# Altium schematic sheet DI23.SchDoc
size A; SheetNumber: 1; SheetTotal: 1
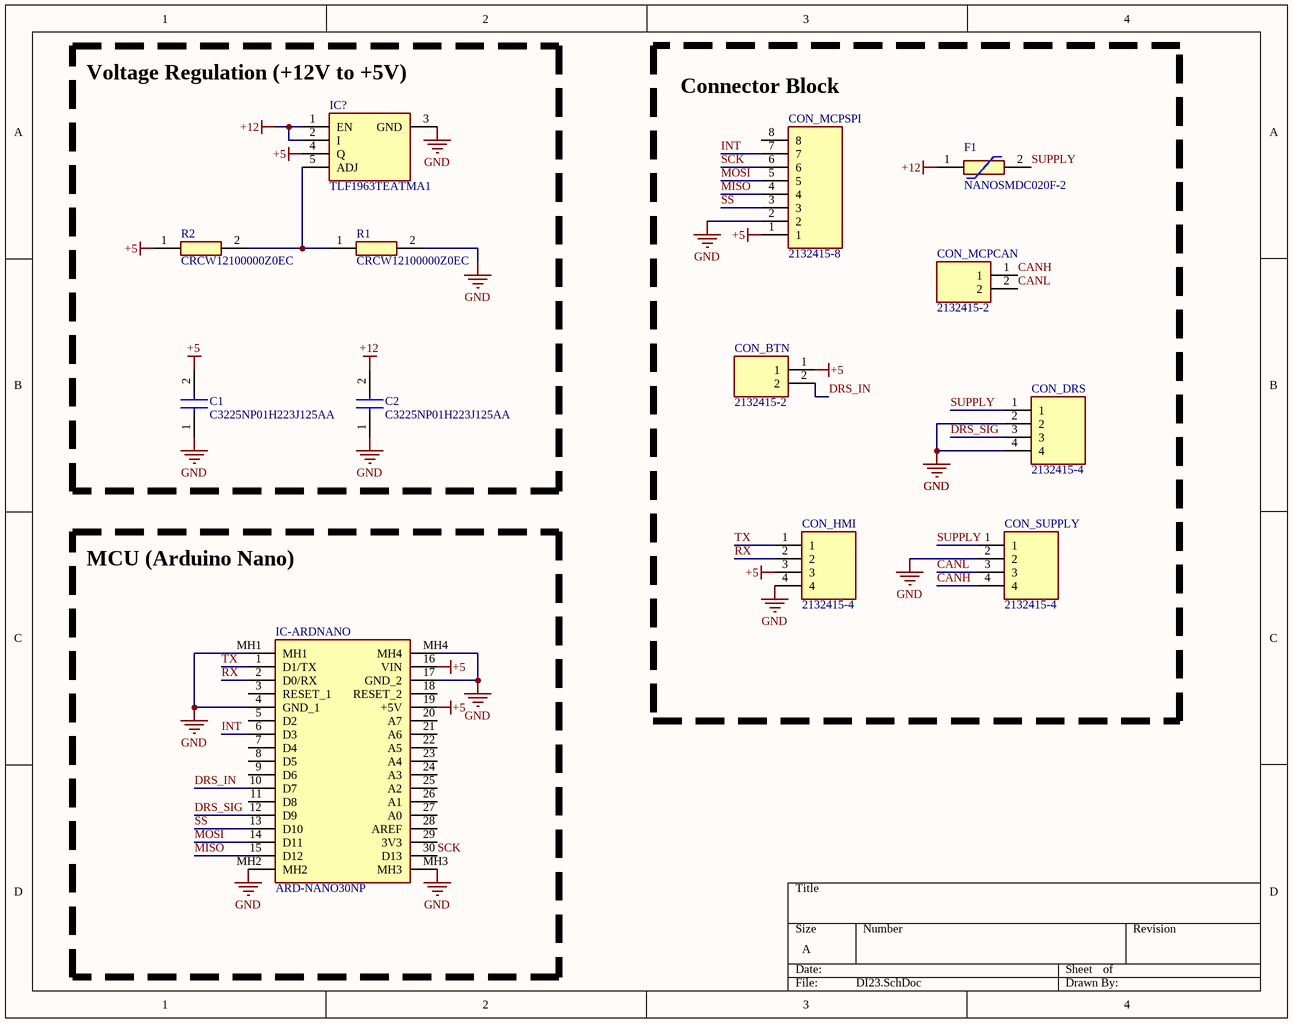
[diagram p0: DI23.SchDoc]

## Parts
C1  C3225NP01H223J125AA  [CAPC3225X125N]
C2  C3225NP01H223J125AA  [CAPC3225X125N]
CON_BTN  2132415-2  [21324152]
CON_DRS  2132415-4  [SHDR4W62P0X250_1X4_1250X640X880P]
CON_HMI  2132415-4  [SHDR4W62P0X250_1X4_1250X640X880P]
CON_MCPCAN  2132415-2  [21324152]
CON_MCPSPI  2132415-8  [21324158]
CON_SUPPLY  2132415-4  [SHDR4W62P0X250_1X4_1250X640X880P]
F1  NANOSMDC020F-2  [NANOSMDC016F2]
IC-ARDNANO  ARD-NANO30NP  [ARDNANO30NP]
IC?  TLF1963TEATMA1  [TLF1963TEATMA1]
R1  CRCW12100000Z0EC  [RESC3225X60N]
R2  CRCW12100000Z0EC  [RESC3225X60N]

## Blocks framed on the sheet
Voltage Regulation (+12V to +5V): C1 C2 IC? R1 R2
Connector Block: CON_BTN CON_DRS CON_HMI CON_MCPCAN CON_MCPSPI CON_SUPPLY F1
MCU (Arduino Nano): IC-ARDNANO

## Nets
+5: C1.2 CON_BTN.1 CON_HMI.3 CON_MCPSPI.1 IC-ARDNANO.16(VIN) IC-ARDNANO.19(+5V) IC?.4(Q) R2.1
+12: C2.2 F1.1 IC?.1(EN) IC?.2(I)
GND: C1.1 C2.1 CON_DRS.2 CON_DRS.4 CON_HMI.4 CON_MCPSPI.2 CON_SUPPLY.2 IC-ARDNANO.4(GND_1) IC-ARDNANO.17(GND_2) IC-ARDNANO.MH1 IC-ARDNANO.MH2 IC-ARDNANO.MH3 IC-ARDNANO.MH4 IC?.3(GND) R1.2
CANH: CON_MCPCAN.1 CON_SUPPLY.4
CANL: CON_MCPCAN.2 CON_SUPPLY.3
DRS_IN: CON_BTN.2 IC-ARDNANO.10(D7)
DRS_SIG: CON_DRS.3 IC-ARDNANO.12(D9)
INT: CON_MCPSPI.7 IC-ARDNANO.6(D3)
MISO: CON_MCPSPI.4 IC-ARDNANO.15(D12)
MOSI: CON_MCPSPI.5 IC-ARDNANO.14(D11)
RX: CON_HMI.2 IC-ARDNANO.2(D0/RX)
SCK: CON_MCPSPI.6 IC-ARDNANO.30(D13)
SS: CON_MCPSPI.3 IC-ARDNANO.13(D10)
SUPPLY: CON_DRS.1 CON_SUPPLY.1 F1.2
TX: CON_HMI.1 IC-ARDNANO.1(D1/TX)
NetIC?_5: IC?.5(ADJ) R1.1 R2.2

Not connected (* = marked no-connect by the designer): CON_MCPSPI 8; IC-ARDNANO 3(RESET_1) 5(D2) 7(D4) 8(D5) 9(D6) 11(D8) 18(RESET_2) 20(A7) 21(A6) 22(A5) 23(A4) 24(A3) 25(A2) 26(A1) 27(A0) 28(AREF) 29(3V3)

## Library data of the parts
C1 C2 = C3225NP01H223J125AA: Capacitor; Manufacturer_Name: TDK; Datasheet Link: https://product.tdk.com/info/en/catalog/datasheets/mlcc_commercial_midvoltage_en.pdf; Height: 1.25mm; Manufacturer_Part_Number: C3225NP01H223J125AA; Mouser Part Number: 810-C3225NP01H223J1A; Mouser Price/Stock: https://www.mouser.co.uk/ProductDetail/TDK/C3225NP01H223J125AA?qs=xLDY6iXSiQYCNOB4fgAXGA%3D%3D
CON_BTN CON_MCPCAN = 2132415-2: Connector; Manufacturer_Name: TE Connectivity; Datasheet Link: https://componentsearchengine.com/Datasheets/1/2132415-2.pdf; Height: 9mm; Manufacturer_Part_Number: 2132415-2; Mouser Part Number: 571-2132415-2; Mouser Price/Stock: https://www.mouser.co.uk/ProductDetail/TE-Connectivity/2132415-2?qs=XhI5AayaxxWCihtdUAcw3Q%3D%3D; Arrow Part Number: 2132415-2; Arrow Price/Stock: https://www.arrow.com/en/products/2132415-2/te-connectivity?region=nac
CON_DRS CON_HMI CON_SUPPLY = 2132415-4: Connector; Manufacturer_Name: TE Connectivity; Datasheet Link: https://www.te.com/commerce/DocumentDelivery/DDEController?Action=srchrtrv&DocNm=2132415&DocType=Customer+Drawing&DocLang=English&DocFormat=pdf&PartCntxt=2132415-4; Height: 8.8mm; Manufacturer_Part_Number: 2132415-4; Mouser Part Number: 571-2132415-4; Mouser Price/Stock: https://www.mouser.co.uk/ProductDetail/TE-Connectivity/2132415-4?qs=XhI5AayaxxVzHDT9ZkxhEA%3D%3D; Arrow Part Number: 2132415-4; Arrow Price/Stock: https://www.arrow.com/en/products/2132415-4/te-connectivity?region=nac
CON_MCPSPI = 2132415-8: Connector; Manufacturer_Name: TE Connectivity; Datasheet Link: https://componentsearchengine.com/Datasheets/2/2132415-8.pdf; Height: 8.93mm; Manufacturer_Part_Number: 2132415-8; Mouser Part Number: 571-2132415-8; Mouser Price/Stock: https://www.mouser.co.uk/ProductDetail/TE-Connectivity/2132415-8?qs=XhI5AayaxxU5%2FK%252BXTeVEJQ%3D%3D; Arrow Part Number: 2132415-8; Arrow Price/Stock: https://www.arrow.com/en/products/2132415-8/te-connectivity?region=nac
F1 = NANOSMDC020F-2: Resettable Fuse; Manufacturer_Name: LITTELFUSE; Datasheet Link: https://www.littelfuse.com/~/media/electronics/datasheets/resettable_ptcs/littelfuse_ptc_nanosmdc_datasheet.pdf.pdf; Height: 1mm; Manufacturer_Part_Number: NANOSMDC020F-2; Mouser Part Number: 650-NANOSMDC020F-2; Mouser Price/Stock: https://www.mouser.co.uk/ProductDetail/Littelfuse/NANOSMDC020F-2?qs=iK0evp%252BCRRU6agwMt7HYjg%3D%3D; Arrow Part Number: NANOSMDC020F-2; Arrow Price/Stock: https://www.arrow.com/en/products/nanosmdc020f-2/littelfuse?region=nac
IC-ARDNANO = ARD-NANO30NP: Integrated Circuit; Manufacturer_Name: Gravitech; Datasheet Link: http://www.mouser.com/datasheet/2/595/Arduino_Nano3_0-220057.pdf; Height: 5mm; Manufacturer_Part_Number: ARD-NANO30NP; Mouser Part Number: 992-ARD-NANO30NP; Mouser Price/Stock: https://www.mouser.co.uk/ProductDetail/Gravitech/ARD-NANO30NP?qs=Vxac6xGyzPlh7in3DWNTbQ%3D%3D
IC? = TLF1963TEATMA1: Integrated Circuit; Manufacturer_Name: Infineon; Datasheet Link: https://www.infineon.com/dgdl/Infineon-TLF1963-DS-v01_00-EN.pdf?fileId=5546d46258fc0bc1015969d2981941e0; Height: 2.35mm; Manufacturer_Part_Number: TLF1963TEATMA1; Mouser Part Number: 726-TLF1963TEATMA1; Mouser Price/Stock: https://www.mouser.co.uk/ProductDetail/Infineon-Technologies/TLF1963TEATMA1?qs=SiyfpgnvCZluIGE%2FbZiglw%3D%3D; Arrow Part Number: TLF1963TEATMA1; Arrow Price/Stock: https://www.arrow.com/en/products/tlf1963teatma1/infineon-technologies-ag?region=nac
R1 R2 = CRCW12100000Z0EC: Resistor; Manufacturer_Name: Vishay; Height: 0.6mm; Manufacturer_Part_Number: CRCW12100000Z0EC